# Altium project c_fan.PrjPCB
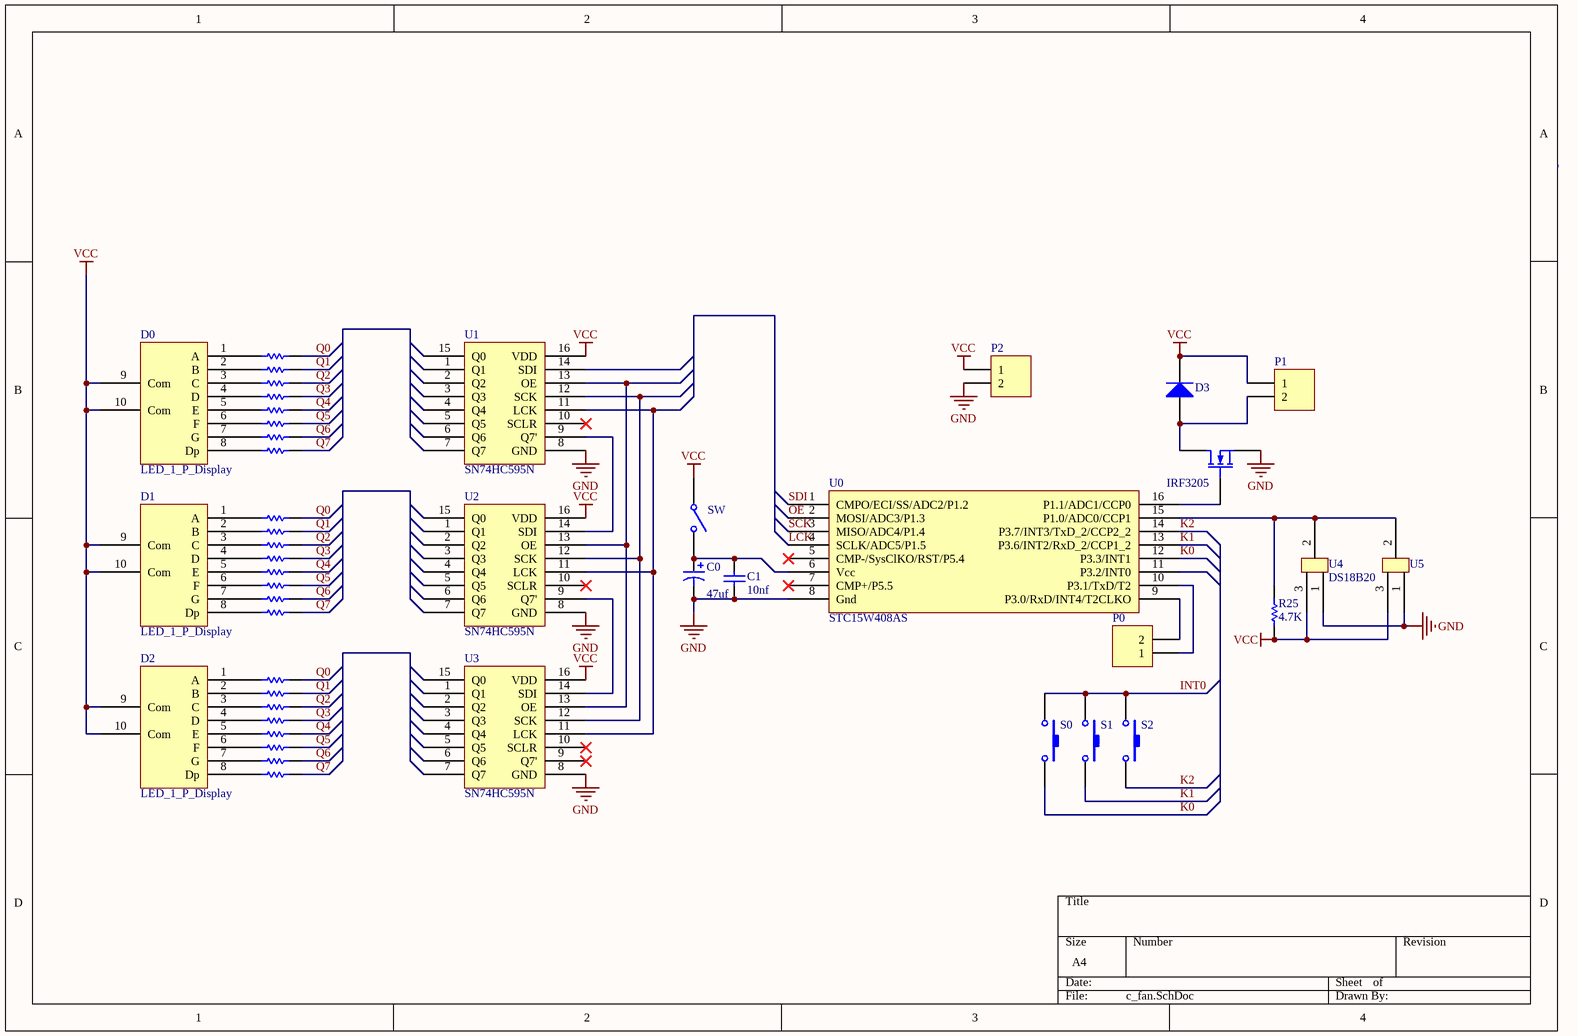
[diagram p0: c_fan.SchDoc]
1 sheet, 45 parts. Net scope: global (net labels, ports and power ports of the same name join across sheets).

## Sheet c_fan.SchDoc
size A4

### Parts
C0  value 47uf  [C0805]  (hidden comment: Cap Pol3)
C1  value 10nf  [C1206]  (hidden comment: Cap Semi)
D0  LED_1_P_Display
D1  LED_1_P_Display
D2  LED_1_P_Display
D3  Diode  [SMC]  (value not drawn)
P0  Header 2  [HDR1X2]  (value not drawn)
P1  Header 2H  [HDR1X2H]  (value not drawn)
P2  Header 2H  [HDR1X2H]  (value not drawn)
Q0  IRF3205  [E3]
R1  Res1  [AXIAL-0.3]  (value not drawn)
R2  Res1  [AXIAL-0.3]  (value not drawn)
R3  Res1  [AXIAL-0.3]  (value not drawn)
R4  Res1  [AXIAL-0.3]  (value not drawn)
R5  Res1  [AXIAL-0.3]  (value not drawn)
R6  Res1  [AXIAL-0.3]  (value not drawn)
R7  Res1  [AXIAL-0.3]  (value not drawn)
R8  Res1  [AXIAL-0.3]  (value not drawn)
R9  Res1  [AXIAL-0.3]  (value not drawn)
R10  Res1  [AXIAL-0.3]  (value not drawn)
R11  Res1  [AXIAL-0.3]  (value not drawn)
R12  Res1  [AXIAL-0.3]  (value not drawn)
R13  Res1  [AXIAL-0.3]  (value not drawn)
R14  Res1  [AXIAL-0.3]  (value not drawn)
R15  Res1  [AXIAL-0.3]  (value not drawn)
R16  Res1  [AXIAL-0.3]  (value not drawn)
R17  Res1  [AXIAL-0.3]  (value not drawn)
R18  Res1  [AXIAL-0.3]  (value not drawn)
R19  Res1  [AXIAL-0.3]  (value not drawn)
R20  Res1  [AXIAL-0.3]  (value not drawn)
R21  Res1  [AXIAL-0.3]  (value not drawn)
R22  Res1  [AXIAL-0.3]  (value not drawn)
R23  Res1  [AXIAL-0.3]  (value not drawn)
R24  Res1  [AXIAL-0.3]  (value not drawn)
R25  value 4.7K  [AXIAL-0.3]  (hidden comment: Res1)
S0  SW-PB  [SPST-2]  (value not drawn)
S1  SW-PB  [SPST-2]  (value not drawn)
S2  SW-PB  [SPST-2]  (value not drawn)
SW  SW-SPST  [SPST-2]  (value not drawn)
U0  STC15W408AS
U1  SN74HC595N
U2  SN74HC595N
U3  SN74HC595N
U4  DS18B20
U5  DS18B20  (value not drawn)

### Nets
GND: C0.2 C1.1 P2.2 Q0.3(S) U0.8(Gnd) U1.8(GND) U2.8(GND) U3.8(GND) U4.1(GND) U5.1(GND)
VCC: D0.9(Com) D0.10(Com) D1.9(Com) D1.10(Com) D2.9(Com) D2.10(Com) D3.2(K) P1.1 P2.1 R25.2 SW.1(COMMON) U1.16(VDD) U2.16(VDD) U3.16(VDD) U4.3(VDD) U5.3(VDD)
INT0: S0.1 S1.1 S2.1
K0: S0.2 U0.12(P3.3/INT1)
K1: S1.2 U0.13(P3.6/INT2/RxD_2/CCP1_2)
K2: S2.2 U0.14(P3.7/INT3/TxD_2/CCP2_2)
LCK: U0.4(SCLK/ADC5/P1.5)
OE: U0.2(MOSI/ADC3/P1.3)
Q0: R1.2 R9.2 R17.2
Q1: R2.2 R10.2 R18.2
Q2: R3.2 R11.2 R19.2
Q3: R4.2 R12.2 R20.2
Q4: R5.2 R13.2 R21.2
Q5: R6.2 R14.2 R22.2
Q6: R7.2 R15.2 R23.2
Q7: R8.2 R16.2 R24.2
SCK: U0.3(MISO/ADC4/P1.4)
SDI: U0.1(CMPO/ECI/SS/ADC2/P1.2)
NetC0_1: C0.1 C1.2 SW.2(NO) U0.6(Vcc)
NetD0_1: D0.1(A) R1.1
NetD0_2: D0.2(B) R2.1
NetD0_3: D0.3(C) R3.1
NetD0_4: D0.4(D) R4.1
NetD0_5: D0.5(E) R5.1
NetD0_6: D0.6(F) R6.1
NetD0_7: D0.7(G) R7.1
NetD0_8: D0.8(Dp) R8.1
NetD1_1: D1.1(A) R9.1
NetD1_2: D1.2(B) R10.1
NetD1_3: D1.3(C) R11.1
NetD1_4: D1.4(D) R12.1
NetD1_5: D1.5(E) R13.1
NetD1_6: D1.6(F) R14.1
NetD1_7: D1.7(G) R15.1
NetD1_8: D1.8(Dp) R16.1
NetD2_1: D2.1(A) R17.1
NetD2_2: D2.2(B) R18.1
NetD2_3: D2.3(C) R19.1
NetD2_4: D2.4(D) R20.1
NetD2_5: D2.5(E) R21.1
NetD2_6: D2.6(F) R22.1
NetD2_7: D2.7(G) R23.1
NetD2_8: D2.8(Dp) R24.1
NetD3_1: D3.1(A) P1.2 Q0.1(D)
NetP0_1: P0.1 U0.10(P3.1/TxD/T2)
NetP0_2: P0.2 U0.9(P3.0/RxD/INT4/T2CLKO)
NetQ0_2: Q0.2(G) U0.16(P1.1/ADC1/CCP0)
NetR25_1: R25.1 U0.15(P1.0/ADC0/CCP1) U4.2(DQ) U5.2(DQ)
NetU1_9: U1.9(Q7') U2.14(SDI)
NetU1_11: U1.11(LCK) U2.11(LCK) U3.11(LCK)
NetU1_12: U1.12(SCK) U2.12(SCK) U3.12(SCK)
NetU1_13: U1.13(OE) U2.13(OE) U3.13(OE)
NetU2_9: U2.9(Q7') U3.14(SDI)

Not connected (* = marked no-connect by the designer): U0 5(CMP-/SysClKO/RST/P5.4)* 7(CMP+/P5.5)* 11(P3.2/INT0); U1 1(Q1) 2(Q2) 3(Q3) 4(Q4) 5(Q5) 6(Q6) 7(Q7) 10(SCLR)* 14(SDI) 15(Q0); U2 1(Q1) 2(Q2) 3(Q3) 4(Q4) 5(Q5) 6(Q6) 7(Q7) 10(SCLR)* 15(Q0); U3 1(Q1) 2(Q2) 3(Q3) 4(Q4) 5(Q5) 6(Q6) 7(Q7) 9(Q7')* 10(SCLR)* 15(Q0)

### Library data of the parts
C0 = Cap Pol3: Polarized Capacitor (Surface Mount); Published: 8-Jun-2000; LatestRevisionDate: 29-May-2009; LatestRevisionNote: IPC-7351 Footprint Added.; PackageReference: C0805; Publisher: Altium Limited; PackageDescription: Chip Capacitor
C1 = Cap Semi: Capacitor (Semiconductor SIM Model); Published: 8-Jun-2000; LatestRevisionDate: 29-May-2009; LatestRevisionNote: IPC-7351 Footprint Added.; PackageReference: C1206; Publisher: Altium Limited; PackageDescription: Chip Capacitor
D0-D2 = LED_1_P_Display: 共阳一位
D3 = Diode: Default Diode; Published: 8-Jun-2000; LatestRevisionDate: 17-Jul-2002; LatestRevisionNote: Re-released for DXP Platform.; PackageVersion: Sep-1996; PackageReference: SMC; Publisher: Altium Limited; PackageDescription: DO-214-AB/SMC; 2 C-Bend Leads; Body 7.9 x 5.9 mm, inc. leads (LxW); Code_JEDEC: DO-214-AB
P0 = Header 2: Header, 2-Pin; LatestRevisionDate: 17-Jul-2002; LatestRevisionNote: Re-released for DXP Platform.; Publisher: Altium Limited
P1 P2 = Header 2H: Header, 2-Pin, Right Angle; LatestRevisionDate: 17-Jul-2002; LatestRevisionNote: Re-released for DXP Platform.; Publisher: Altium Limited
Q0 = MOSFET-N: N-Channel MOSFET; Published: 8-Jun-2000; LatestRevisionDate: 17-Jul-2002; LatestRevisionNote: Re-released for DXP Platform.; PackageVersion: 1995/1996; PackageReference: E3; Publisher: Altium Limited; PackageDescription: TO, Flat Index; 3 In-Line, Axial Leads; Body Dia. 4.6mm; Lead Dia. 0.5 mm (max)
R1-R24 = Res1: Resistor; Value: 620R; Published: 8-Jun-2000; LatestRevisionDate: 17-Jul-2002; LatestRevisionNote: Re-released for DXP Platform.; PackageReference: AXIAL-0.3; Publisher: Altium Limited; PackageDescription: Axial Device, Thru-Hole; 2 Leads; 0.3 in Pin Spacing
R25 = Res1: Resistor; Published: 8-Jun-2000; LatestRevisionDate: 17-Jul-2002; LatestRevisionNote: Re-released for DXP Platform.; PackageReference: AXIAL-0.3; Publisher: Altium Limited; PackageDescription: Axial Device, Thru-Hole; 2 Leads; 0.3 in Pin Spacing
S0-S2 = SW-PB: Switch; Published: 24-Mar-1999; LatestRevisionDate: 17-Jul-2002; LatestRevisionNote: Re-released for DXP Platform.; PackageReference: SPST-2; Publisher: Altium Limited; PackageDescription: Switch; 2 Leads
SW = SW-SPST: Single-Pole, Single-Throw Switch; Published: 24-Mar-1999; LatestRevisionDate: 17-Jul-2002; LatestRevisionNote: Re-released for DXP Platform.; PackageReference: SPST-2; Publisher: Altium Limited; PackageDescription: Switch; 2 Leads
U1-U3 = 74HC595